# Altium schematic sheet 07_Connectors_ESP32.SchDoc
size A4; SheetNumber: 7; SheetTotal: 9
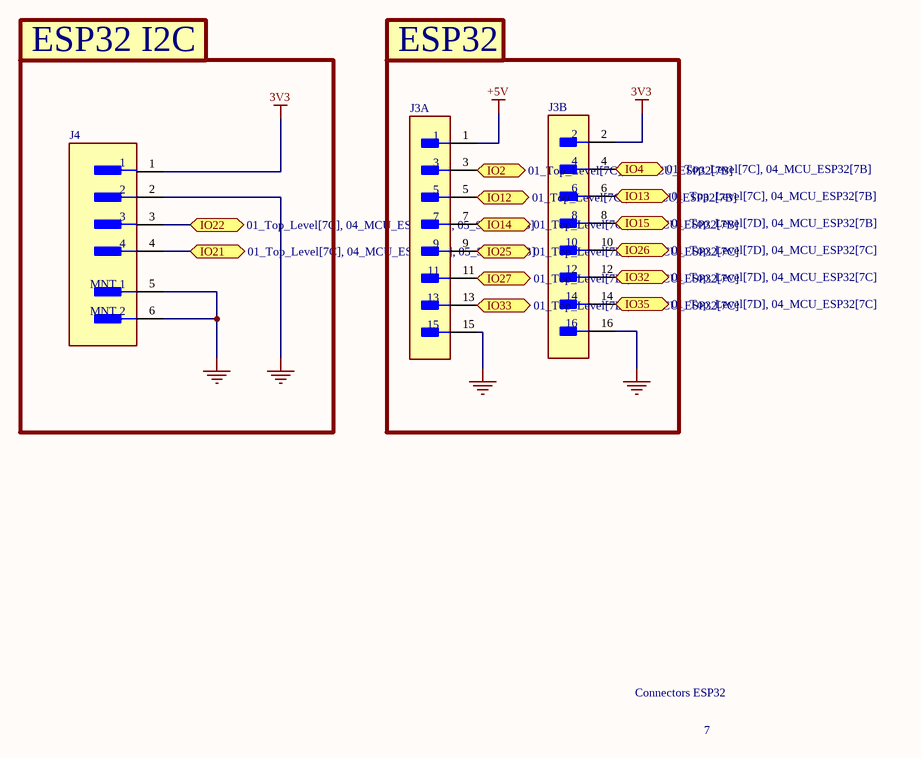
[diagram p0: 07_Connectors_ESP32.SchDoc]

## Parts
J3  GRPB082MWCN-RC  [FP-GRPB082MWCN-RC-MFG]  (value not drawn)  (parts A,B of 2)
J4  533980471  [FP-533980471-MFG]  (value not drawn)

## Blocks framed on the sheet
ESP32 I2C: J4
ESP32: J3

## Ports
IO2 (bidir, see 01_Top_Level[7C], 04_MCU_ESP32[7B]), IO4 (bidir, see 01_Top_Level[7C], 04_MCU_ESP32[7B]), IO12 (bidir, see 01_Top_Level[7C], 04_MCU_ESP32[7B]), IO13 (bidir, see 01_Top_Level[7C], 04_MCU_ESP32[7B]), IO14 (bidir, see 01_Top_Level[7C], 04_MCU_ESP32[7B]), IO15 (bidir, see 01_Top_Level[7D], 04_MCU_ESP32[7B]), IO21 (bidir, see 01_Top_Level[7C], 04_MCU_ESP32[7C], 05_Sensors[4B]), IO22 (bidir, see 01_Top_Level[7C], 04_MCU_ESP32[7C], 05_Sensors[4B]), IO25 (bidir, see 01_Top_Level[7D], 04_MCU_ESP32[7C]), IO26 (bidir, see 01_Top_Level[7D], 04_MCU_ESP32[7C]), IO27 (bidir, see 01_Top_Level[7D], 04_MCU_ESP32[7C]), IO32 (bidir, see 01_Top_Level[7D], 04_MCU_ESP32[7C]), IO33 (bidir, see 01_Top_Level[7D], 04_MCU_ESP32[7C]), IO35 (bidir, see 01_Top_Level[7D], 04_MCU_ESP32[7C])

## Nets
3V3: J3.2 J4.1
+5V: J3.1
GND: J3.15 J3.16 J4.2 J4.5(MNT_1) J4.6(MNT_2)
IO2: J3.3 ; port IO2
IO4: J3.4 ; port IO4
IO12: J3.5 ; port IO12
IO13: J3.6 ; port IO13
IO14: J3.7 ; port IO14
IO15: J3.8 ; port IO15
IO21: J4.4 ; port IO21
IO22: J4.3 ; port IO22
IO25: J3.9 ; port IO25
IO26: J3.10 ; port IO26
IO27: J3.11 ; port IO27
IO32: J3.12 ; port IO32
IO33: J3.13 ; port IO33
IO35: J3.14 ; port IO35

## Notes on the sheet
- Connectors ESP32
- 7

## Library data of the parts
J3 = CMP-25680-000081-1: CONN HEADER R/A 16POS 1.27MM; Number of Positions: 16; Row Spacing: 0.05inch; Max Operating Temperature: 105°C; Flammability Rating: UL94 V-0; Contact Type: Male Pin; Termination: Solder; Contact Material: Brass; Package Quantity: 1; Lead Free: Lead Free; Min Operating Temperature: -40°C; Contact Shape: Square; Insulation Material: Nylon; Contact Plating: Gold; Connector Type: Header; Mount: Through Hole; Pitch: 1.27mm; RoHS Compliant: Yes; Fastening Type: Pull; Number of Rows: 2; Contact Mating Length: 0.118inch; Series: -; Packaging: Bulk; Contact Finish - Mating: GOLD
J4 = CMP-04776-000105-1: CONN HEADER SMD 4POS 1.25MM; Manufacturer: Molex; Conn Gender: Male; Description: Connector Header Surface Mount 4 position 0.049" (1.25mm); Conn Orientation: Vertical; Standoff Height: 0.05mm; Number Of Contacts: 4; Current Rating: 1A; Voltage Rating: 125V; Package: 0; ComponentLink2Description: Datasheet; ComponentLink2URL: https://www.molex.com/pdm_docs/ps/PS-51021-024-001.pdf; Ambient Temperature Range Low: -40°C; Category: Conn; Automotive: No; Number Of Rows: 1; Device Class L3: unset; Ambient Temperature Range High: +105°C; Height: 5.1mm; Lead Free: Yes; Pitch: 1.25mm; Contact Material: Tin; Footprint Url: https://www.molex.com/pdm_docs/sd/533980471_sd.pdf; Octopart: https://octopart.com/53398-0471-molex-655296; Temperature Range Low: -40°C; Device Class L2: Headers and Wire Housings; Temperature: -40°C to +105°C; Digikey Description: CONN HEADER SMD 4POS 1.25MM; RoHS: TRUE; Manufacturer Part Number: 533980471; Device Class L1: Connectors; Temperature Range High: +105°C